# EAGLE design TASC_cells_board (EAGLE 9.4.2)
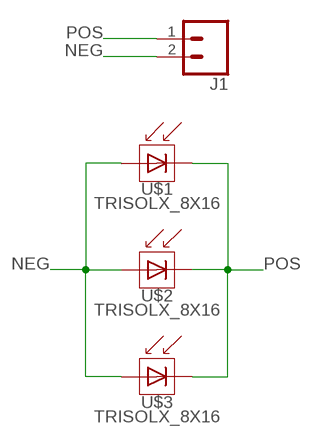
[diagram p0: schematic, sheet 1]

## Parts
J1  CONN_02  [1X02]
U$1  TRISOLX_8X16  [TRISOLX_8X16]
U$2  TRISOLX_8X16  [TRISOLX_8X16]
U$3  TRISOLX_8X16  [TRISOLX_8X16]

## Nets
NEG: J1.2 U$1.P$2(A) U$2.P$2(A) U$3.P$2(A)
POS: J1.1 U$1.P$3(C) U$2.P$3(C) U$3.P$3(C)

## Library data of the parts
J1 = SparkFun-Connectors:CONN_02: Multi connection point. Often used as Generic Header-pin footprint for 0.1 inch spaced/style header connections On any of the 0.1 inch spaced packages, you can populate with these: Break Away Headers - Straight <https://www.sparkfun.com/products/116> (PRT-00116) Break Away Male Headers - Right Angle <https://www.sparkfun.com/products/553> (PRT-00553) Female Headers <https://www.sparkfun.com/products/115> (PRT-00115) Break Away Headers - Machine Pin <https://www.sparkfun.com/products/117> (PRT-00117) Break Away Female Headers - Swiss Machine Pin <https://www.sparkfun.com/products/743> (PRT-00743) For SCREWTERMINALS and SPRING TERMINALS visit here: Screw Terimnals on SparkFun.com <https://www.sparkfun.com/search/results?term=Screw+Terminals> (5mm/3.5mm/2.54mm spacing) This device is also useful as a general connection point to wire up your design to another part of your project. Our various solder wires solder well into these plated through hole pads. Hook-Up Wire - Assortment (Stranded, 22 AWG) <https://www.sparkfun.com/products/11375> (PRT-11375) Hook-Up Wire - Assortment (Solid Core, 22 AWG) <https://www.sparkfun.com/products/11367> (PRT-11367) View the entire wire category on our website here <https://www.sparkfun.com/categories/141> Special notes: Molex polarized connector foot print use with: PRT-08233 with associated crimp pins and housings. 2.54_SCREWTERM for use with PRT-10571. 3.5mm Screw Terminal footprints for PRT-08084 5mm Screw Terminal footprints for use with PRT-08432
U$1-U$3 = TrisolX_Solar_Cells:TRISOLX_8X16

## Board
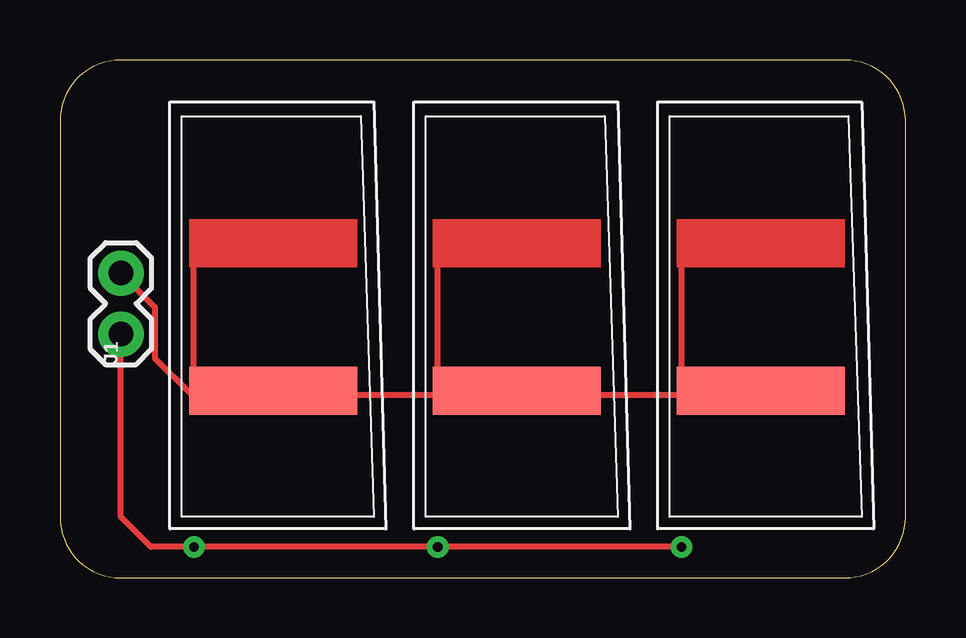
[diagram p1: board, top side]

Size 35.23 x 21.58 mm. Coordinates in mm from the lower left corner, seen from the top.
Outline: 0,19.04 0,2.54 arc90 2.54,0 32.69,0 arc90 35.23,2.54 35.23,19.04 arc90 32.69,21.58 2.54,21.58 arc90 0,19.04
Copper layers (1*16): Top 0.035mm / dielectric 1.5mm / Bottom 0.035mm
Design rules "default": minimum track width 6mil, minimum drill 0.35mm, track to track 6mil, track to pad 6mil, pad to pad 6mil, via to via 6mil, smd to smd 6mil, copper to edge 40mil, drill to drill 6mil, minimum pad ring 10mil, minimum via ring 8mil, stop-mask expansion 4mil, vias tented up to drill 0mil, thermal gap 10mil

### Footprints (pad centres in the part's own frame; a part is rotated, then mirrored left to right if it is on the bottom)
1X02 = drill 1.016 pad 1.88: 1 0,0; 2 2.54,0
TRISOLX_8X16 = smd 7 x 2: P$2 3.8,5.25 | drill 0.4: P$3 0.5,-1.25

### Placement (x,y rotation side)
J1  2.54,10.16 90 top
U$1  15.24,2.54 0 top
U$2  25.4,2.54 0 top
U$3  5.08,2.54 0 top

### Tracks (layer width: path | path; a pad name or v marks a point on that pad's centre or on a via)
NEG
  Top 0.152: U$2.P$2 29.03,7.62 | 17.78,7.62 17.95,7.79 U$1.P$2 18.87,7.62 | 7.62,7.62 7.79,7.79 U$3.P$2 | 7.62,7.62 8.89,7.62 | 7.62,7.62 7.56,7.68 5.43,7.68
  Top 0.254: 29.03,7.62 17.78,7.62 | 18.87,7.62 8.89,7.62 | 5.43,7.68 3.95,9.16 3.95,11.29 J1.2
POS
  Top 0.254: U$2.P$3 U$1.P$3 U$3.P$3 3.79,1.29 2.54,2.54 J1.1